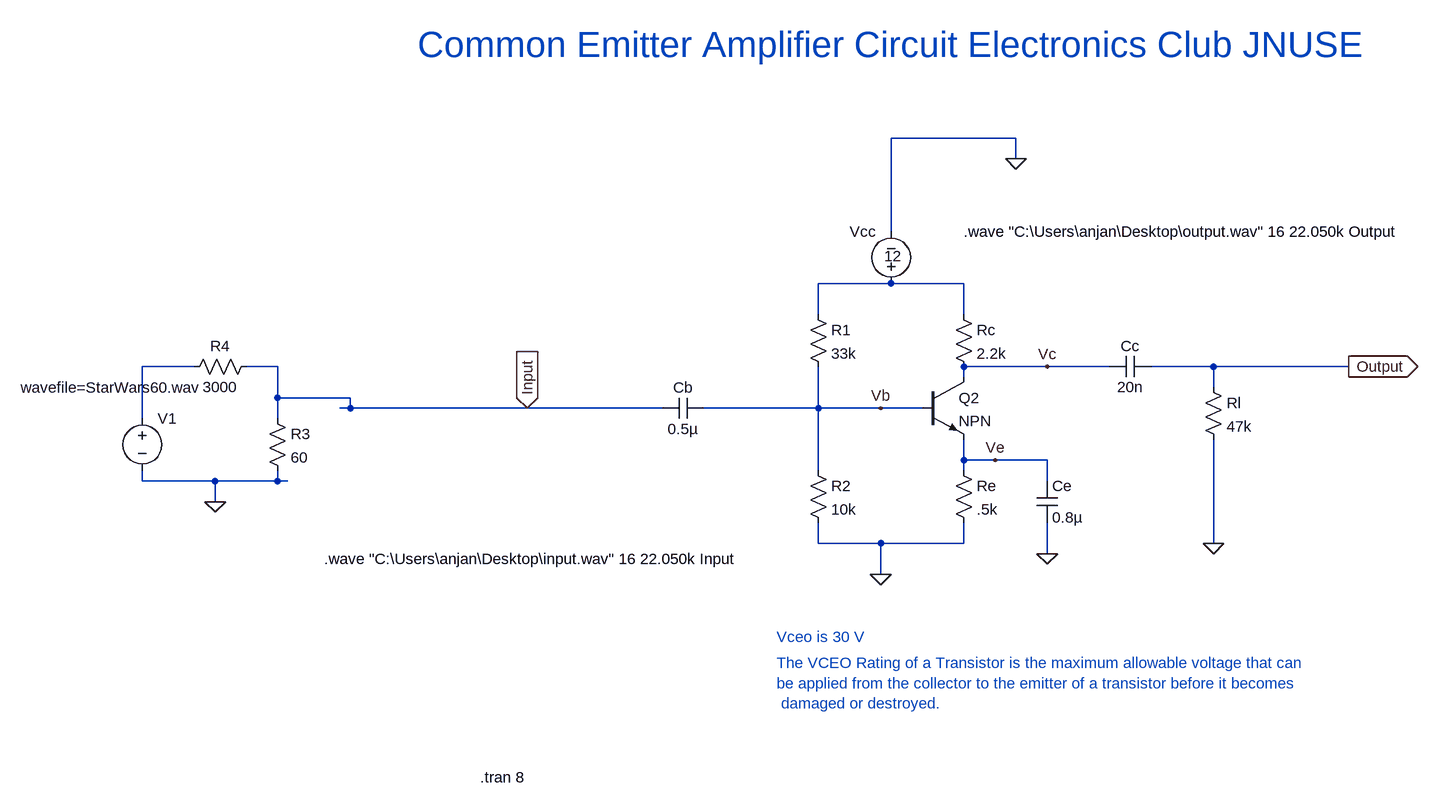
[diagram p0: schematic SimpleAmplifier.asc]
SimpleAmplifier.asc, the LTspice schematic file:
Version 4
SHEET 1 1504 680
WIRE 256 -480 64 -480
WIRE 256 -448 256 -480
WIRE 64 -336 64 -480
WIRE 64 -256 -48 -256
WIRE 176 -256 64 -256
WIRE -48 -208 -48 -256
WIRE 176 -208 176 -256
WIRE -1008 -128 -1088 -128
WIRE -880 -128 -928 -128
WIRE 304 -128 176 -128
WIRE 400 -128 304 -128
WIRE 560 -128 464 -128
WIRE 768 -128 560 -128
WIRE 176 -112 176 -128
WIRE 560 -96 560 -128
WIRE -880 -80 -880 -128
WIRE -768 -80 -880 -80
WIRE -768 -64 -768 -80
WIRE -768 -64 -784 -64
WIRE -496 -64 -768 -64
WIRE -288 -64 -496 -64
WIRE -48 -64 -48 -128
WIRE -48 -64 -224 -64
WIRE 48 -64 -48 -64
WIRE 112 -64 48 -64
WIRE -1088 -48 -1088 -128
WIRE -880 -48 -880 -80
WIRE 176 16 176 -16
WIRE 224 16 176 16
WIRE 304 16 224 16
WIRE -48 32 -48 -64
WIRE 176 32 176 16
WIRE -1088 48 -1088 32
WIRE -976 48 -1088 48
WIRE -880 48 -880 32
WIRE -880 48 -976 48
WIRE -864 48 -880 48
WIRE 304 48 304 16
WIRE -976 80 -976 48
WIRE -48 144 -48 112
WIRE 48 144 -48 144
WIRE 176 144 176 112
WIRE 176 144 48 144
WIRE 560 144 560 -16
WIRE 304 160 304 112
WIRE 48 192 48 144
FLAG 48 192 0
FLAG 304 160 0
FLAG 256 -448 0
FLAG 560 144 0
FLAG 304 -128 Vc
FLAG 224 16 Ve
FLAG 48 -64 Vb
FLAG -496 -64 Input
IOPIN -496 -64 In
FLAG 768 -128 Output
IOPIN 768 -128 Out
FLAG -976 80 0
SYMBOL res 160 16 R0
SYMATTR InstName Re
SYMATTR Value .5k
SYMBOL res 160 -224 R0
SYMATTR InstName Rc
SYMATTR Value 2.2k
SYMBOL voltage 64 -240 R180
WINDOW 0 24 96 Left 2
WINDOW 3 -16 58 Left 2
WINDOW 123 0 0 Left 0
WINDOW 39 0 0 Left 0
SYMATTR InstName Vcc
SYMATTR Value 12
SYMBOL cap 288 48 R0
SYMATTR InstName Ce
SYMATTR Value 0.8µ
SYMBOL res -64 -224 R0
SYMATTR InstName R1
SYMATTR Value 33k
SYMBOL res -64 16 R0
SYMATTR InstName R2
SYMATTR Value 10k
SYMBOL cap -224 -80 R90
WINDOW 0 0 32 VBottom 2
WINDOW 3 32 32 VTop 2
SYMATTR InstName Cb
SYMATTR Value 0.5µ
SYMBOL cap 464 -144 R90
WINDOW 0 0 32 VBottom 2
WINDOW 3 32 32 VTop 2
SYMATTR InstName Cc
SYMATTR Value 20n
SYMBOL res 544 -112 R0
SYMATTR InstName Rl
SYMATTR Value 47k
SYMBOL npn 112 -112 R0
SYMATTR InstName Q2
SYMBOL voltage -1088 -64 R0
WINDOW 3 -187 -32 Left 2
SYMATTR InstName V1
SYMATTR Value wavefile=StarWars60.wav
SYMBOL res -896 -64 R0
SYMATTR InstName R3
SYMATTR Value 60
SYMBOL res -912 -144 R90
WINDOW 0 0 56 VBottom 2
WINDOW 3 32 56 VTop 2
SYMATTR InstName R4
SYMATTR Value 3000
TEXT -112 328 Left 2 ;The VCEO Rating of a Transistor is the maximum allowable voltage that can \nbe applied from the collector to the emitter of a transistor before it becomes\n damaged or destroyed.
TEXT -112 288 Left 2 ;Vceo is 30 V
TEXT -568 504 Left 2 !.tran 8
TEXT 176 -336 Left 2 !.wave "C:\\Users\\anjan\\Desktop\\output.wav" 16 22.050k Output
TEXT -808 168 Left 2 !.wave "C:\\Users\\anjan\\Desktop\\input.wav" 16 22.050k Input
TEXT -664 -624 Left 5 ;Common Emitter Amplifier Circuit Electronics Club JNUSE

The netlist it stands for:
* SimpleAmplifier.asc
Re Ve 0 .5k
Rc N001 Vc 2.2k
Vcc N001 0 12
Ce Ve 0 0.8µ
R1 N001 Vb 33k
R2 Vb 0 10k
Cb Vb Input 0.5µ
Cc Output Vc 20n
Rl Output 0 47k
Q2 Vc Vb Ve 0 NPN
V1 N002 0 wavefile=StarWars60.wav
R3 Input 0 60
R4 Input N002 3000
.model NPN NPN
.model PNP PNP
.lib standard.bjt
* The VCEO Rating of a Transistor is the maximum allowable voltage that can
* be applied from the collector to the emitter of a transistor before it becomes
*  damaged or destroyed.
* Vceo is 30 V
.tran 8
.wave "C:\Users\anjan\Desktop\output.wav" 16 22.050k Output
.wave "C:\Users\anjan\Desktop\input.wav" 16 22.050k Input
* Common Emitter Amplifier Circuit Electronics Club JNUSE
.backanno
.end